# Altium schematic sheet OpenTx_NucleoF412zg.SchDoc: Nucleo-F412ZG Open TX Wiring Diagram
size A2
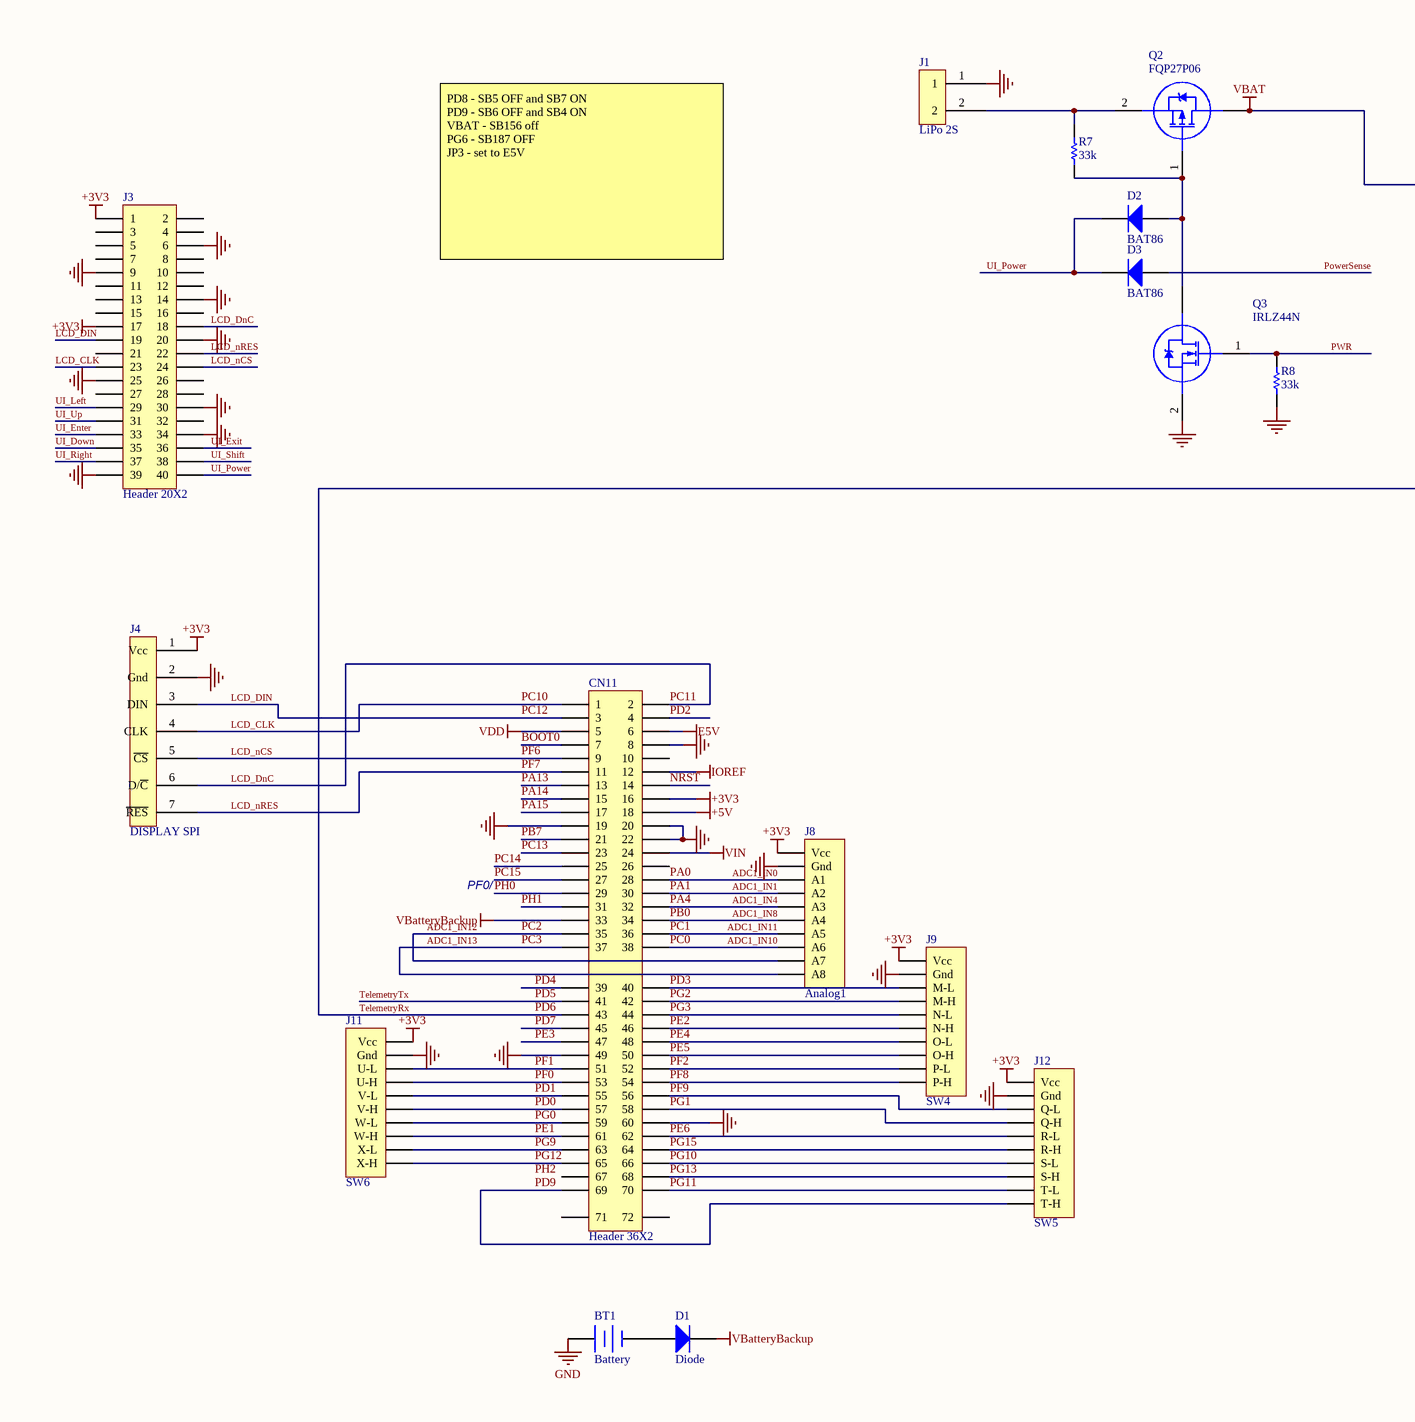
[diagram p0: OpenTx_NucleoF412zg.SchDoc, left]
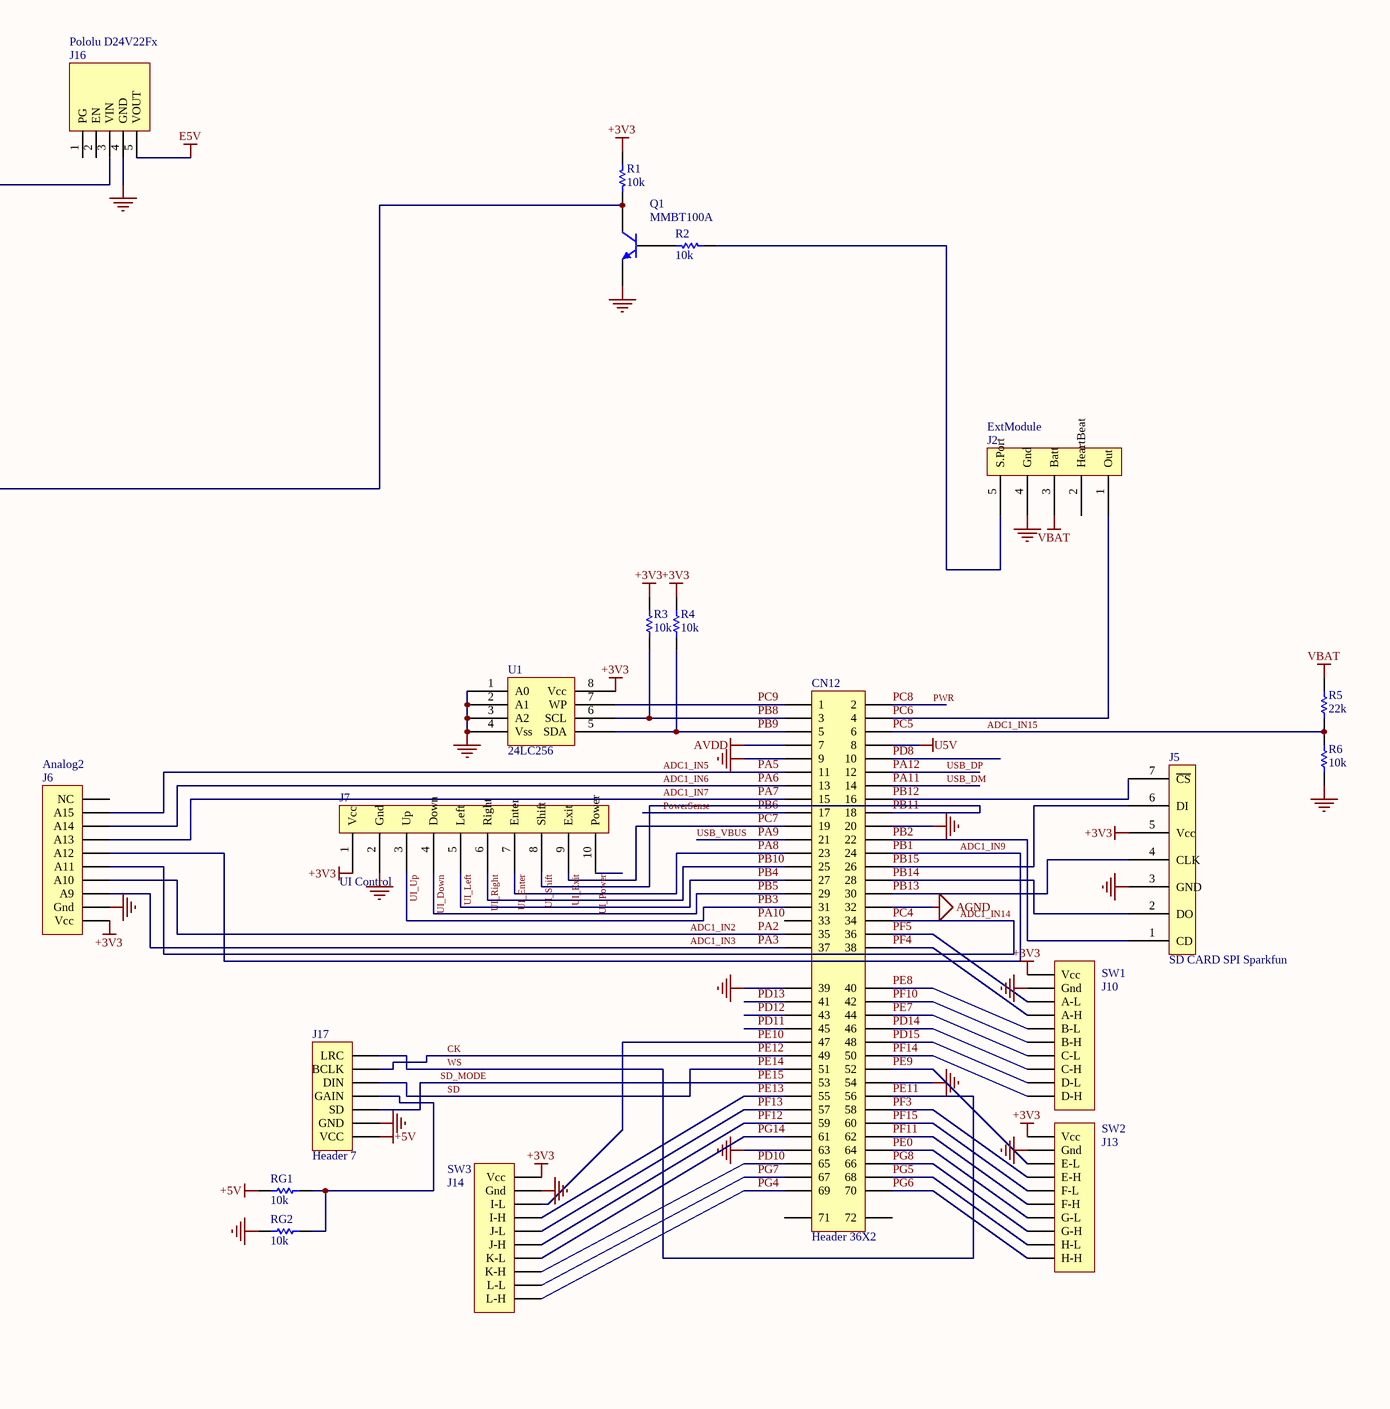
[diagram p1: OpenTx_NucleoF412zg.SchDoc, right]

## Parts
BT1  Battery  [Button Cell Holder 20mm]
CN11  Header 36X2  [HDR35x2 Bottom]
CN12  Header 36X2  [HDR35x2 Bottom]
D1  Diode  [DO-35 400]
D2  BAT86  [DO-35 200]
D3  BAT86  [DO-35 200]
J1  LiPo 2S  [0.1 SIP 2 PIN]
J2  ExtModule  [0.1 SIP 5 PIN]
J3  Header 20X2  [HDR20x2 Shrouded]
J4  DISPLAY SPI  [0.1 SIP 8 PIN]
J5  SD CARD SPI Sparkfun  [Sparkfun SD Card]
J6  Analog2  [0.1 SIP 10 PIN]
J7  UI Control  [0.1 SIP 10 PIN]
J8  Analog1  [0.1 SIP 10 PIN]
J9  SW4  [0.1 SIP 10 PIN]
J10  SW1  [0.1 SIP 10 PIN]
J11  SW6  [0.1 SIP 10 PIN]
J12  SW5  [0.1 SIP 10 PIN]
J13  SW2  [0.1 SIP 10 PIN]
J14  SW3  [0.1 SIP 10 PIN]
J16  Pololu D24V22Fx  [Pololu D24V22Fx]
J17  Header 7  [ADAFruit I2S MAX98357A]
Q1  MMBT100A  [TO-92 0.1"]
Q2  FQP27P06  [TO-220]
Q3  IRLZ44N  [TO-220]
R1  value 10k  [Resistor Axial 1/8W 0.4]  (hidden comment: Res1)
R2  value 10k  [Resistor Axial 1/8W 0.4]  (hidden comment: Res1)
R3  value 10k  [Resistor Axial 1/8W 0.4]  (hidden comment: Res1)
R4  value 10k  [Resistor Axial 1/8W 0.4]  (hidden comment: Res1)
R5  value 22k  [Resistor Axial 1/8W 0.4]  (hidden comment: Res1)
R6  value 10k  [Resistor Axial 1/8W 0.4]  (hidden comment: Res1)
R7  value 33k  [Resistor Axial 1/8W 0.4]  (hidden comment: Res1)
R8  value 33k  [Resistor Axial 1/8W 0.4]  (hidden comment: Res1)
RG1  value 10k  [Resistor Axial 1/8W 0.4]  (hidden comment: Res1)
RG2  value 10k  [Resistor Axial 1/8W 0.4]  (hidden comment: Res1)
U1  24LC256  [DIP8]

## Nets
+3V3: CN11.16 J3.1 J3.17 J4.1(Vcc) J5.5(Vcc) J6.1(Vcc) J7.1(Vcc) J8.1(Vcc) J9.1(Vcc) J10.1(Vcc) J11.1(Vcc) J12.1(Vcc) J13.1(Vcc) J14.1(Vcc) R1.1 R3.1 R4.1 U1.8(Vcc)
+5V: CN11.18 J17.7(VCC) RG1.1
AGND: CN12.32
AVDD: CN12.7
E5V: CN11.6 J16.5(VOUT)
GND: BT1.1(+) CN11.8 CN11.19 CN11.20 CN11.22 CN11.49 CN11.60 CN12.9 CN12.20 CN12.39 CN12.54 CN12.63 J1.1 J2.4(Gnd) J3.6 J3.9 J3.14 J3.20 J3.25 J3.30 J3.34 J3.39 J4.2(Gnd) J5.3(GND) J6.2(Gnd) J7.2(Gnd) J8.2(Gnd) J9.2(Gnd) J10.2(Gnd) J11.2(Gnd) J12.2(Gnd) J13.2(Gnd) J14.2(Gnd) J16.4(GND) J17.6(GND) Q1.E Q3.2(S) R6.2 R8.2 RG2.1 U1.1(A0) U1.2(A1) U1.3(A2) U1.4(Vss)
IOREF: CN11.12
U5V: CN12.8
VBAT: J2.3(Batt) J16.3(VIN) Q2.3(D) R5.1
VBatteryBackup: CN11.33 D1.2(K)
VDD: CN11.5
VIN: CN11.24
ADC1_IN0: CN11.28 J8.3(A1)  [also labelled PA0]
ADC1_IN1: CN11.30 J8.4(A2)  [also labelled PA1]
ADC1_IN2: CN12.35 J6.4(A10)  [also labelled PA2]
ADC1_IN3: CN12.37 J6.3(A9)  [also labelled PA3]
ADC1_IN4: CN11.32 J8.5(A3)  [also labelled PA4]
ADC1_IN5: CN12.11 J6.9(A15)  [also labelled PA5]
ADC1_IN6: CN12.13 J6.8(A14)  [also labelled PA6]
ADC1_IN7: CN12.15 J6.7(A13)  [also labelled PA7]
ADC1_IN8: CN11.34 J8.6(A4)  [also labelled PB0]
ADC1_IN9: CN12.24 J6.6(A12)  [also labelled PB1]
ADC1_IN10: CN11.38 J8.8(A6)  [also labelled PC0]
ADC1_IN11: CN11.36 J8.7(A5)  [also labelled PC1]
ADC1_IN12: CN11.35 J8.9(A7)  [also labelled PC2]
ADC1_IN13: CN11.37 J8.10(A8)  [also labelled PC3]
ADC1_IN14: CN12.34 J6.5(A11)  [also labelled PC4]
ADC1_IN15: CN12.6 R5.2 R6.1  [also labelled PC5]
BOOT0: CN11.7
CK: CN12.49 J17.2(BCLK)  [also labelled PE12]
LCD_CLK: CN11.1 J3.23 J4.4(CLK)  [also labelled PC10]
LCD_DIN: CN11.3 J3.19 J4.3(DIN)  [also labelled PC12]
LCD_DnC: CN11.2 J3.18 J4.6(D/~{C})  [also labelled PC11]
LCD_nCS: CN11.9 J3.24 J4.5(~{CS})  [also labelled PF6]
LCD_nRES: CN11.11 J3.22 J4.7(~{RES})  [also labelled PF7]
NRST: CN11.14
PA8: CN12.23 J3.33 J7.7(Enter)  [also labelled UI_Enter]
PA9: CN12.21  [also labelled USB_VBUS]
PA11: CN12.14  [also labelled USB_DM]
PA12: CN12.12  [also labelled USB_DP]
PA13: CN11.13
PA14: CN11.15
PA15: CN11.17
PB2: CN12.22 J5.1(CD)
PB3: CN12.31 J3.31 J7.3(Up)  [also labelled UI_Up]
PB4: CN12.27 J3.29 J7.5(Left)  [also labelled UI_Left]
PB5: CN12.29 J3.35 J7.4(Down)  [also labelled UI_Down]
PB6: CN12.17 D3.1(A)  [also labelled PowerSense]
PB7: CN11.21
PB8: CN12.3 R3.2 U1.6(SCL)
PB9: CN12.5 R4.2 U1.5(SDA)
PB10: CN12.25 J3.37 J7.6(Right)  [also labelled UI_Right]
PB11: CN12.18 J3.38 J7.8(Shift)  [also labelled UI_Shift]
PB12: CN12.16 J5.7(~{CS})
PB13: CN12.30 J5.4(CLK)
PB14: CN12.28 J5.2(DO)
PB15: CN12.26 J5.6(DI)
PC6: CN12.4 J2.1(Out)
PC7: CN12.19 J3.36 J7.9(Exit)  [also labelled UI_Exit]
PC8: CN12.2 Q3.1(G) R8.1  [also labelled PWR]
PC9: CN12.1 U1.7(WP)
PC13: CN11.23
PC14: CN11.25
PC15: CN11.27
PD0: CN11.57 J11.6(V-H)
PD1: CN11.55 J11.5(V-L)
PD2: CN11.4
PD3: CN11.40 J9.3(M-L)
PD4: CN11.39
PD5: CN11.41  [also labelled TelemetryTx]
PD6: CN11.43 Q1.C R1.2  [also labelled TelemetryRx]
PD7: CN11.45
PD8: CN12.10
PD9: CN11.69 J12.10(T-H)
PD10: CN12.65 J14.8(K-H)
PD11: CN12.45
PD12: CN12.43
PD13: CN12.41
PD14: CN12.46 J10.8(C-H)
PD15: CN12.48 J10.9(D-L)
PE0: CN12.64 J13.7(G-L)
PE1: CN11.61 J11.8(W-H)
PE2: CN11.46 J9.6(N-H)
PE3: CN11.47
PE4: CN11.48 J9.7(O-L)
PE5: CN11.50 J9.8(O-H)
PE6: CN11.62 J12.5(R-L)
PE7: CN12.44 J10.7(C-L)
PE8: CN12.40 J10.5(B-L)
PE9: CN12.52 J13.3(E-L)
PE10: CN12.47 J14.3(I-L)
PE11: CN12.56 J17.1(LRC)  [also labelled WS]
PE13: CN12.55 J14.4(I-H)
PE14: CN12.51 J17.3(DIN)  [also labelled SD]
PE15: CN12.53 J17.5(SD)  [also labelled SD_MODE]
PF0: CN11.53 J11.4(U-H)
PF1: CN11.51 J11.3(U-L)
PF2: CN11.52 J9.9(P-L)
PF3: CN12.58 J13.4(E-H)
PF4: CN12.38 J10.4(A-H)
PF5: CN12.36 J10.3(A-L)
PF8: CN11.54 J9.10(P-H)
PF9: CN11.56 J12.3(Q-L)
PF10: CN12.42 J10.6(B-H)
PF11: CN12.62 J13.6(F-H)
PF12: CN12.59 J14.6(J-H)
PF13: CN12.57 J14.5(J-L)
PF14: CN12.50 J10.10(D-H)
PF15: CN12.60 J13.5(F-L)
PG0: CN11.59 J11.7(W-L)
PG1: CN11.58 J12.4(Q-H)
PG2: CN11.42 J9.4(M-H)
PG3: CN11.44 J9.5(N-L)
PG4: CN12.69 J14.10(L-H)
PG5: CN12.68 J13.9(H-L)
PG6: CN12.70 J13.10(H-H)
PG7: CN12.67 J14.9(L-L)
PG8: CN12.66 J13.8(G-H)
PG9: CN11.63 J11.9(X-L)
PG10: CN11.66 J12.7(S-L)
PG11: CN11.70 J12.9(T-L)
PG12: CN11.65 J11.10(X-H)
PG13: CN11.68 J12.8(S-H)
PG14: CN12.61 J14.7(K-L)
PG15: CN11.64 J12.6(R-H)
PH0: CN11.29
PH1: CN11.31
UI_Power: D2.2(K) D3.2(K) J3.40 J7.10(Power)
NetBT1_2: BT1.2(-) D1.1(A)
NetD2_1: D2.1(A) Q2.1(G) Q3.3(D) R7.2
NetJ1_2: J1.2 Q2.2(S) R7.1
NetJ2_5: J2.5(S.Port) R2.1
NetJ17_4: J17.4(GAIN) RG1.2 RG2.2
NetQ1_B: Q1.B R2.2

Not connected (* = marked no-connect by the designer): CN11 10 26 67 71 72; CN12 33 71 72; J2 2(HeartBeat); J3 2 3 4 5 7 8 10 11 12 13 15 16 21 26 27 28 32; J6 10(NC); J16 1(PG) 2(EN)

## Notes on the sheet
- PD8 - SB5 OFF and SB7 ON
  PD9 - SB6 OFF and SB4 ON
  VBAT - SB156 off
  PG6 - SB187 OFF
  JP3 - set to E5V
- PF0/
- (near CN11) /PH1
- (near CN11) /PH0
- Labels drawn without touching a wire or pin: PA10, PH2

## Library data of the parts
BT1 = Battery: Multicell Battery; pin to pad: 1>- 2>+; Published: 24-Mar-1999; LatestRevisionDate: 17-Jul-2002; LatestRevisionNote: Re-released for DXP Platform.; PackageReference: BAT-2; Publisher: Altium Limited; PackageDescription: Battery; 2 Leads
CN11 CN12 = Header 36X2: Header, 36-Pin, Dual row; pin to pad: 71>69 72>70; Revision: 17-Jul-2002: Re-released for DXP Platform.; Publisher: Altium Limited
D2 D3 = Diode: Published: 8-Jun-2000; LatestRevisionDate: 17-Jul-2002; LatestRevisionNote: Re-released for DXP Platform.; PackageVersion: Sep-1996; PackageReference: SMC; Publisher: Altium Limited; PackageDescription: DO-214-AB/SMC; 2 C-Bend Leads; Body 7.9 x 5.9 mm, inc. leads (LxW); Code_JEDEC: DO-214-AB
J1 = SIP2 CONNECTOR
J2 = SIP5 CONNECTOR
J3 = Header 20X2: Header, 20-Pin, Dual row; LatestRevisionDate: 17-Jul-2002; LatestRevisionNote: Re-released for DXP Platform.; Publisher: Altium Limited
J4 J5 = SIP7 CONNECTOR
J6 J8-J14 = Header 10: Header, 10-Pin; LatestRevisionDate: 17-Jul-2002; LatestRevisionNote: Re-released for DXP Platform.; Publisher: Altium Limited
J7 = SIP10 CONNECTOR
J17 = Header 7: Header, 7-Pin; LatestRevisionDate: 17-Jul-2002; LatestRevisionNote: Re-released for DXP Platform.; Publisher: Altium Limited
Q1 = MMBT100A: General Purpose Amplifier NPN Silicon; pin to pad: B>2 C>1 E>3; Package Information: Latest Revision: 1997; Published: 29-Sep-2000; Revision: 17-Jul-2002: Re-released for DXP Platform.; Datasheet: Latest Revision: 1996; Package Reference: 318-08; Publisher: Altium Limited
Q2 = NTR4101P: HEXFET Power MOSFET; pin to pad: 2>3 3>2; Revision 1: 29-Sep-2000: Re-orientated a 'Drain' pin on first part.; Revision 2: 17-Jul-2002: Re-released for DXP Platform.; Package Information: Latest Revision: Feb-2001; Code - JEDEC: MS-012-AA; Published: 8-Jun-2000; Datasheet: Latest Revision: Dec-1997; Package Reference: SO-8; Publisher: Altium Limited
Q3 = NTR4501N: HEXFET Power MOSFET; pin to pad: 2>3 3>2; Revision 1: 29-Sep-2000: Re-orientated a 'Drain' pin on first part.; Revision 2: 17-Jul-2002: Re-released for DXP Platform.; Package Information: Latest Revision: Feb-2001; Code - JEDEC: MS-012-AA; Published: 8-Jun-2000; Datasheet: Latest Revision: Dec-1997; Package Reference: SO-8; Publisher: Altium Limited
R1-R8 RG1 RG2 = Resistor
D1 = Diode: Published: 8-Jun-2000; LatestRevisionDate: 17-Jul-2002; LatestRevisionNote: Re-released for DXP Platform.; PackageVersion: Sep-1996; PackageReference: SMC; Publisher: Altium Limited; PackageDescription: DO-214-AB/SMC; 2 C-Bend Leads; Body 7.9 x 5.9 mm, inc. leads (LxW); Code_JEDEC: DO-214-AB